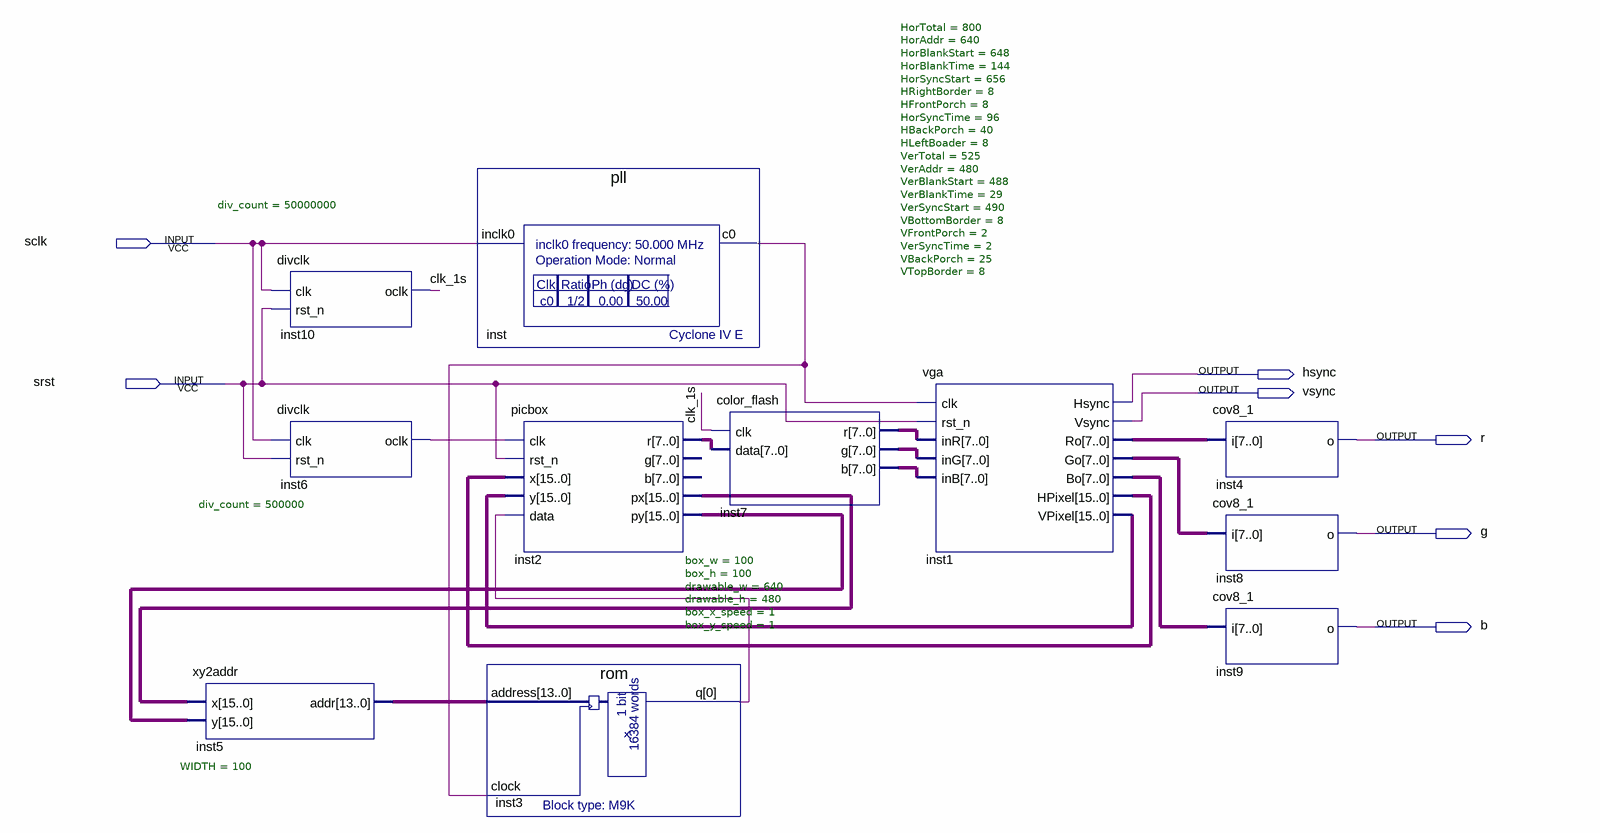
[diagram p0: schematic sheet]
// Quartus schematic hj_move.bdf as structural Verilog: 11 symbols, 7 pins
module hj_move (
  input  sclk,
  input  srst,
  output hsync,
  output vsync,
  output r,
  output g,
  output b
);

  wire clk_1s, inst3_q, inst6_oclk, inst_c0;
  wire [7:0] inst1_bo, inst1_go, inst1_ro, inst2_r, inst7_b, inst7_g, inst7_r;
  wire [13:0] inst5_addr;
  wire [15:0] inst1_hpixel, inst1_vpixel, inst2_px, inst2_py;

  xy2addr #(.WIDTH(100)) inst5 (.x(inst2_px), .y(inst2_py), .addr(inst5_addr));
  divclk #(.div_count(50000000)) inst10 (.clk(sclk), .rst_n(srst), .oclk(clk_1s));
  divclk #(.div_count(500000)) inst6 (.clk(sclk), .rst_n(srst), .oclk(inst6_oclk));
  pll inst (.inclk0(sclk), .c0(inst_c0));
  picbox #(.box_w(100), .box_h(100), .drawable_w(640), .drawable_h(480), .box_x_speed(1), .box_y_speed(1)) inst2 (
    .clk(inst6_oclk), .rst_n(srst), .x(inst1_hpixel), .y(inst1_vpixel), .data(inst3_q), .r(inst2_r),
    .px(inst2_px), .py(inst2_py));  // open: g, b
  rom inst3 (.address(inst5_addr), .clock(inst_c0), .q(inst3_q));
  color_flash inst7 (.clk(clk_1s), .data(inst2_r), .r(inst7_r), .g(inst7_g), .b(inst7_b));
  vga #(.HorTotal(800), .HorAddr(640), .HorBlankStart(648), .HorBlankTime(144), .HorSyncStart(656), .HRightBorder(8), .HFrontPorch(8), .HorSyncTime(96), .HBackPorch(40), .HLeftBoader(8), .VerTotal(525), .VerAddr(480), .VerBlankStart(488), .VerBlankTime(29), .VerSyncStart(490), .VBottomBorder(8), .VFrontPorch(2), .VerSyncTime(2), .VBackPorch(25), .VTopBorder(8)) inst1 (
    .clk(inst_c0), .rst_n(srst), .inR(inst7_r), .inG(inst7_g), .inB(inst7_b), .Hsync(hsync), .Vsync(vsync),
    .Ro(inst1_ro), .Go(inst1_go), .Bo(inst1_bo), .HPixel(inst1_hpixel), .VPixel(inst1_vpixel));
  cov8_1 inst4 (.i(inst1_ro), .o(r));
  cov8_1 inst8 (.i(inst1_go), .o(g));
  cov8_1 inst9 (.i(inst1_bo), .o(b));
endmodule
